# EAGLE board Talon_I2C (EAGLE 9.6.2)
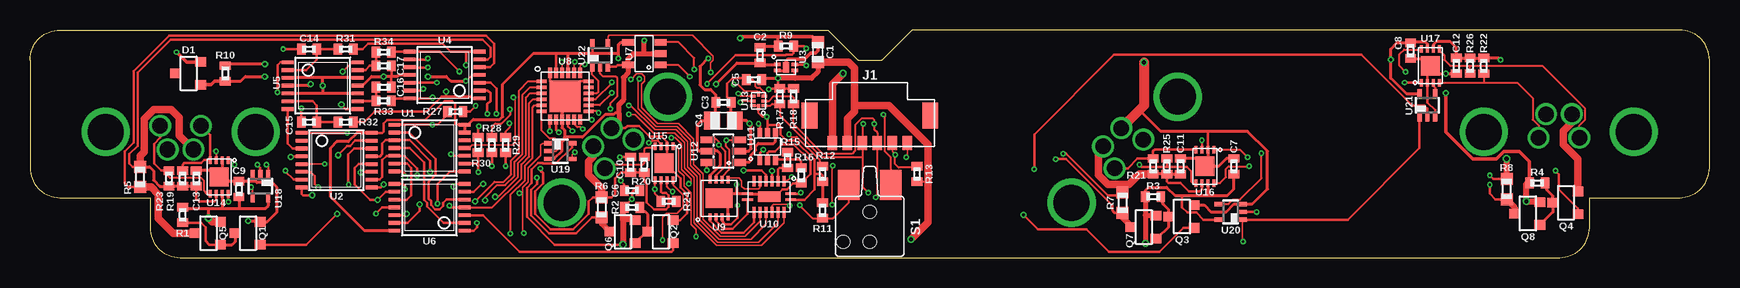
[diagram p3: board, top side]
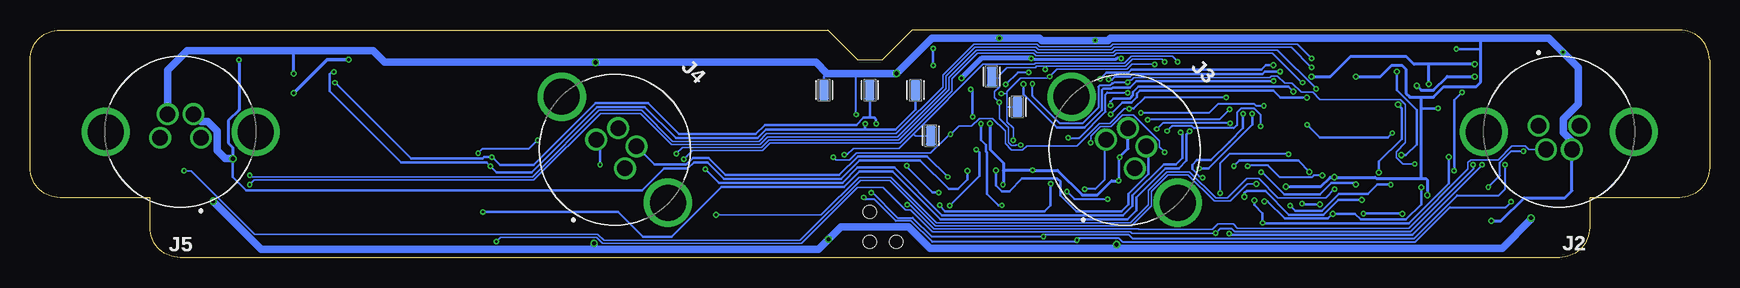
[diagram p4: board, bottom side, seen from below]

Size 140 x 19 mm. Coordinates in mm from the lower left corner, seen from the top.
Outline: 130,5 137.5,5 arc90 140,7.5 140,16.5 arc90 137.5,19 73.5,19 71,16.5 69,16.5 66.5,19 2.5,19 arc90 0,16.5 0,7.5 arc90 2.5,5 10,5 10,2.5 arc90 12.5,0 127.5,0 arc90 130,2.5 130,5
Copper layers (1*16): Top 0.035559375mm / dielectric 1.6mm / Bottom 0.035559375mm
Design rules "jlcpcb-2layer *": minimum track width 5mil, minimum drill 0.2mm, track to track 5mil, track to pad 5mil, pad to pad 5mil, via to via 6mil, smd to smd 5mil, copper to edge 15mil, drill to drill 0.5mm, minimum pad ring 5mil, minimum via ring 5mil, stop-mask expansion 2.5mil, vias tented up to drill 0mil, thermal gap 10mil

## Footprints (pad centres in the part's own frame; a part is rotated, then mirrored left to right if it is on the bottom)
C0603 = smd 1 x 1: 1 -0.85,0; 2 0.85,0
C0402 = smd 0.7 x 0.9: 1 -0.65,0; 2 0.65,0
C0805 = smd 1.3 x 1.5: 1 -0.95,0; 2 0.95,0
SOT23-3 = smd 0.8 x 0.9: 1 -0.95,-1; 2 0.95,-1; 3 0,1.1
1X06_MICROLOCKPLUS = smd 0.8 x 1.2: 1 -3.125,-0.6; 2 -1.875,-0.6; 3 -0.625,-0.6; 4 0.625,-0.6; 5 1.875,-0.6; 6 3.125,-0.6 | smd 1.3 x 2.15: BODY@1 -5.025,1.695; BODY@2 5.025,1.695
1X04_M8_TE_T404103_BOARDLOCK = drill 1.3: 1 1.7,-0.5; 2 1.075,1.475; 3 -1.7,-0.5; 4 -1.075,1.475 | drill 3: S1 -6.25,0; S2 6.25,0
R0402 = smd 0.7 x 0.9: 1 -0.65,0; 2 0.65,0
R0603 = smd 1 x 1: 1 -0.85,0; 2 0.85,0
ESE-22MH = smd 1.8 x 2.5: 1 -1.75,-2.25; 2 1.75,-2.25 | hole 1.1: 0,0; 0,2.5; 2.2,2.5
TESTPOINT_0603 = smd 1.6 x 0.8: 1 0,0
TSSOP14 = smd 0.305 x 0.991: 1 -1.95,-2.918; 2 -1.3,-2.918; 3 -0.65,-2.918; 4 0,-2.918; 5 0.65,-2.918; 6 1.3,-2.918; 7 1.95,-2.918; 8 1.95,2.918; 9 1.3,2.918; 10 0.65,2.918; 11 0,2.918; 12 -0.65,2.918; 13 -1.3,2.918; 14 -1.95,2.918
TSSOP16 = smd 0.305 x 0.991: 1 -2.275,-2.918; 2 -1.625,-2.918; 3 -0.975,-2.918; 4 -0.325,-2.918; 5 0.325,-2.918; 6 0.975,-2.918; 7 1.625,-2.918; 8 2.275,-2.918; 9 2.275,2.918; 10 1.625,2.918; 11 0.975,2.918; 12 0.325,2.918; 13 -0.325,2.918; 14 -0.975,2.918; 15 -1.625,2.918; 16 -2.275,2.918
TDFN_4 = smd 0.55 x 0.3: 1 -0.725,0.25; 2 -0.725,-0.25; 3 0.725,-0.25; 4 0.725,0.25 | smd 0.5 x 0.86: EP 0,0
SOT23-5 = smd 0.55 x 1: 1 -0.95,-1.35; 2 0,-1.35; 3 0.95,-1.35; 4 0.95,1.35; 5 -0.95,1.35
QFN24 = smd 0.85 x 0.3: 1 -1.95,1.25; 2 -1.95,0.75; 3 -1.95,0.25; 4 -1.95,-0.25; 5 -1.95,-0.75; 6 -1.95,-1.25; 13 1.95,-1.25; 14 1.95,-0.75; 15 1.95,-0.25; 16 1.95,0.25; 17 1.95,0.75; 18 1.95,1.25 | smd 0.3 x 0.85: 7 -1.25,-1.95; 8 -0.75,-1.95; 9 -0.25,-1.95; 10 0.25,-1.95; 11 0.75,-1.95; 12 1.25,-1.95; 19 1.25,1.95; 20 0.75,1.95; 21 0.25,1.95; 22 -0.25,1.95; 23 -0.75,1.95; 24 -1.25,1.95 | smd 2.6 x 2.6: EP 0,0
DFN_8_3X3 = smd 0.6 x 0.25: 1 -1.55,0.75; 2 -1.55,0.25; 3 -1.55,-0.25; 4 -1.55,-0.75; 5 1.55,-0.75; 6 1.55,-0.25; 7 1.55,0.25; 8 1.55,0.75 | smd 1.65 x 2.25: EP 0,0
VQFN-16 = smd 0.9 x 0.24: 1 -1.8,-0.25; 8 1.8,-0.25; 9 1.8,0.25; 16 -1.8,0.25 | smd 0.24 x 0.9: 2 -1.25,-1.3; 3 -0.75,-1.3; 4 -0.25,-1.3; 5 0.25,-1.3; 6 0.75,-1.3; 7 1.25,-1.3; 10 1.25,1.3; 11 0.75,1.3; 12 0.25,1.3; 13 -0.25,1.3; 14 -0.75,1.3; 15 -1.25,1.3 | smd 1.9 x 0.9: EP 0,0
DCK_R-PDSO-G6 = smd 0.4 x 0.9: 1 -0.65,-1.1; 2 0,-1.1; 3 0.65,-1.1; 4 0.65,1.1; 5 0,1.1; 6 -0.65,1.1
SOT23-6L = smd 0.55 x 1.2: 1 -0.95,-1.3; 2 0,-1.3; 3 0.95,-1.3; 4 0.95,1.3; 5 0,1.3; 6 -0.95,1.3
UQFN-8_1.4X1.2 = smd 0.55 x 0.25: 1 -0.53,0 | smd 0.25 x 0.45: 2 -0.4,-0.475; 3 0,-0.475; 4 0.4,-0.475; 6 0.4,0.475; 7 0,0.475; 8 -0.4,0.475 | smd 0.45 x 0.25: 5 0.58,0
WSON-8_2X3 = smd 0.25 x 0.625: 1 -0.75,-1.4; 2 -0.25,-1.4; 3 0.25,-1.4; 4 0.75,-1.4; 5 0.75,1.4; 6 0.25,1.4; 7 -0.25,1.4; 8 -0.75,1.4 | smd 1.6 x 1.6: EP 0,0
DCK_R-PDSO-G5 = smd 0.35 x 0.8: 1 -0.65,-0.95; 2 0,-0.95; 3 0.65,-0.95; 4 0.65,0.95; 5 -0.65,0.95

## Placement (x,y rotation side)
C1  1uF  [C0603]  65.68,17.14 90 top
C2  0.1uF  [C0402]  60.86,16.89 90 top
C3  0.1uF  [C0402]  57.81,12.95 0 top
C4  10uF  [C0805]  57.81,11.43 0 top
C5  0.1uF  [C0402]  60.35,14.86 180 top
C6  0.1uF  [C0402]  50.19,5.59 180 top
C7  0.1uF  [C0402]  100.35,7.62 90 top
C8  0.1uF  [C0402]  115.09,17.27 270 top
C9  0.1uF  [C0402]  17.42,5.71 90 top
C10  0.1uF  [C0402]  50.06,7.75 90 top
C11  0.1uF  [C0402]  95.91,7.62 90 top
C12  0.1uF  [C0402]  118.9,16 270 top
C13  0.1uF  [C0402]  13.87,6.6 90 top
C14  DNP  [C0402]  23.26,17.4 180 top
C15  DNP  [C0402]  23.26,11.3 180 top
C16  DNP  [C0402]  29.49,14.22 0 top
C17  DNP  [C0402]  29.49,16 0 top
D1  2.048V  [SOT23-3]  13.23,15.37 90 top
J1  CONN_TALON_REMOTE  [1X06_MICROLOCKPLUS]  70,10.16 0 top
J2  CONN_I2C_LOGGER  [1X04_M8_TE_T404103_BOARDLOCK]  12.55,10.5 180 bottom
J3  CONN_I2C_LOGGER  [1X04_M8_TE_T404103_BOARDLOCK]  48.75,9 315 bottom
J4  CONN_I2C_LOGGER  [1X04_M8_TE_T404103_BOARDLOCK]  91.25,9 315 bottom
J5  CONN_I2C_LOGGER  [1X04_M8_TE_T404103_BOARDLOCK]  127.45,10.5 0 bottom
Q1  2N7002  [SOT23-3]  18.18,2.03 90 top
Q2  2N7002  [SOT23-3]  52.6,2.16 90 top
Q3  2N7002  [SOT23-3]  96.03,3.43 90 top
Q4  2N7002  [SOT23-3]  128.04,4.57 90 top
Q5  AO3419  [SOT23-3]  14.88,2.03 90 top
Q6  AO3419  [SOT23-3]  49.43,2.16 90 top
Q7  AO3419  [SOT23-3]  92.86,2.54 90 top
Q8  AO3419  [SOT23-3]  124.86,3.68 90 top
R1  10k  [R0402]  12.72,3.56 90 top
R2  10k  [R0402]  50.19,4.19 180 top
R3  10k  [R0402]  93.62,5.08 180 top
R4  10k  [R0402]  125.64,6.22 180 top
R5  82m  [R0603]  9.17,6.73 90 top
R6  82m  [R0603]  47.65,4.19 90 top
R7  82m  [R0603]  91.08,4.57 90 top
R8  82m  [R0603]  123.09,5.71 90 top
R9  100k  [R0402]  63.02,17.65 0 top
R10  10k  [R0402]  16.28,15.37 90 top
R11  1M  [R0402]  66.06,3.94 90 top
R12  100k  [R0402]  66.06,6.99 270 top
R13  100k  [R0402]  73.94,6.99 270 top
R15  10k  [R0402]  63.14,8.13 270 top
R16  10k  [R0402]  64.28,6.86 90 top
R17  10k  [R0402]  62.51,13.46 90 top
R18  10k  [R0402]  63.65,13.46 90 top
R19  10k  [R0402]  12.72,6.6 270 top
R20  10k  [R0402]  51.2,7.75 270 top
R21  10k  [R0402]  93.62,7.62 270 top
R22  10k  [R0402]  121.18,16 90 top
R23  10k  [R0402]  11.58,6.6 270 top
R24  10k  [R0402]  53.24,4.7 0 top
R25  10k  [R0402]  94.77,7.62 270 top
R26  10k  [R0402]  120.04,16 90 top
R27  1k  [R0402]  35.46,12.19 180 top
R28  1k  [R0402]  38.5,9.4 270 top
R29  1k  [R0402]  39.65,9.4 270 top
R30  1k  [R0402]  37.36,9.4 270 top
R31  1k  [R0402]  26.31,17.4 180 top
R32  1k  [R0402]  26.31,11.3 180 top
R33  1k  [R0402]  29.49,13.08 180 top
R34  1k  [R0402]  29.49,17.14 180 top
S1  ESE-22MH  [ESE-22MH]  70,3.81 180 top
TP1  TESTPOINTRCU  [TESTPOINT_0603]  73.81,13.97 270 bottom
TP2  TESTPOINTRCU  [TESTPOINT_0603]  70,13.97 270 bottom
TP3  TESTPOINTRCU  [TESTPOINT_0603]  66.19,13.97 270 bottom
TP4  TESTPOINTRCU  [TESTPOINT_0603]  59.84,15.11 270 bottom
TP5  TESTPOINTRCU  [TESTPOINT_0603]  57.68,12.57 270 bottom
TP6  TESTPOINTRCU  [TESTPOINT_0603]  64.92,10.16 270 bottom
U1  SN74HC04  [TSSOP14]  33.3,9.14 270 top
U2  CD4044  [TSSOP16]  25.55,8.13 270 top
U3  SIP32431TDFN  [TDFN_4]  63.02,15.88 0 top
U4  INA4180A2  [TSSOP14]  34.57,15.24 90 top
U5  MAX9034TSSOP  [TSSOP14]  24.41,14.35 270 top
U6  SN74AC08  [TSSOP14]  33.3,4.19 90 top
U7  AT24MAC602SOT23  [SOT23-5]  51.2,17.02 90 top
U8  PCAL9535AQFN  [QFN24]  44.6,13.46 0 top
U9  PCA9536DFN  [DFN_8_3X3]  57.43,4.95 90 top
U10  74HC4852  [VQFN-16]  61.62,5.08 180 top
U11  SN74LVC1G3157SC70  [DCK_R-PDSO-G6]  61.49,9.27 0 top
U12  MCP3421A3  [SOT23-6L]  57.81,8.89 90 top
U13  FXMAR2102UMLP  [UQFN-8_1.4X1.2]  60.73,13.08 90 top
U14  PCA9617WSON  [WSON-8_2X3]  15.77,6.73 180 top
U15  PCA9617WSON  [WSON-8_2X3]  52.86,7.87 180 top
U16  PCA9617WSON  [WSON-8_2X3]  97.94,7.62 180 top
U17  PCA9617WSON  [WSON-8_2X3]  116.74,16 0 top
U18  SN74AUP1G08DCK  [DCK_R-PDSO-G5]  19.2,5.97 180 top
U19  SN74AUP1G08DCK  [DCK_R-PDSO-G5]  44.22,8.89 270 top
U20  SN74AUP1G08DCK  [DCK_R-PDSO-G5]  100.1,3.81 90 top
U21  SN74AUP1G08DCK  [DCK_R-PDSO-G5]  116.48,12.7 0 top
U22  SN74AUP1G32DCK  [DCK_R-PDSO-G5]  47.52,16.89 0 top

## Tracks (layer width: path | path; a pad name or v marks a point on that pad's centre or on a via)
3V3  (via drill 0.2, 0.25, 0.35)
  Top 0.152: U15.7 53.11,5.91 53.52,5.5 v53.56,5.5 | v61.43,11.75 61.05,11.75 60.73,12.06 U13.1 60.73,12.68 U13.8 | R13.2 73.95,6.35 74.85,6.35
  Top 0.2: R12.2 66.06,6.86 65.94,6.99 65.39,6.99 | U10.16 64.54,4.83 65.39,5.67 65.39,6.99 | 65.39,6.99 65.39,8.17 63.78,9.78 63.08,9.78 62.57,10.29 62.57,10.91 62.44,11.05 61.49,11.05 | U18.5 19.85,5.27 | C6.1 50.31,5.59 50.18,5.45 v50.18,4.89 49.54,4.25 R2.2 49.54,4.32 | U19.5 45.17,9.21 43.8,7.84 42.77,7.84 42.72,7.89 42.34,7.89 41.81,7.36 41.81,6.21 41.43,5.83 41.43,3.4 43.74,1.08 v49.43,1.08 | U20.5 97.83,3.16 97.24,3.75 96.49,3.75 96.03,4.21 96.03,5.17 | U1.14 35.54,11.09 35.46,11.18 35.46,12.83 35.2,13.08 34.56,13.08 32.95,11.47 29.79,11.47 29.49,11.17 29.49,10.54 29.35,10.4 U2.16 | v61.43,11.75 61.49,11.68 61.49,11.05 | 61.49,11.05 U11.5 | v61.57,14.06 61.62,14.11 R17.2 | R17.2 63.61,14.11 63.63,14.13 | v62.36,14.96 62.36,14.26 R17.2 | U8.23 43.85,17.05 43.84,17.06 | U22.5 46.89,17.83 46.89,17.06
  Top 0.254: C4.1 57.17,11.12 | C4.1 55.97,11.43 55.65,11.11 55.65,9.02 55.78,8.89 U12.5 | U12.5 56.41,8.89 | U6.14 27.88,2.24 25.04,5.08 25.04,9.14 25.57,9.67 26.52,9.67 27.26,10.4 U2.16 | R12.2 R11.2 | C4.1 57.16,11.73 C3.1 57.16,13.6 56.74,14.02 56.23,14.02 55.85,14.4 55.85,15.95 v56.54,16.64 | U1.13 U1.14 36.52,11.09 36.95,11.52 39.16,11.52 39.4,11.76 39.4,14.48 41.97,17.06 43.84,17.06 44.85,17.06 | v49.04,16.64 v49.05,16.64 49.05,17.02 | U9.8 56.68,6.87 57.55,7.75 57.55,8.64 57.3,8.89 U12.5 | R3.2 92.97,5.6 93.24,5.87 94.75,5.87 95.44,5.17 96.03,5.17 98.19,5.17 | C7.1 100.35,5.71 99.81,5.17 98.19,5.17 | U16.7 98.19,5.17 | U17.7 116.49,17.83 116.28,18.03 115.2,18.03 C8.1 113.96,17.92 113.43,17.4 v113.43,16.51 113.43,14.98 114.76,13.65 U21.5 | C5.1 61.1,14.96 v62.36,14.96 | U3.3 63.74,15 63.78,14.96 | 63.63,14.13 R18.2 | 49.05,17.02 49.05,17.78 49.23,17.97 U7.4 | U18.5 19.85,4.33 19.58,4.06 17.42,4.06 | 17.42,4.06 16.02,4.06 | 16.02,4.06 14.88,4.06 | 14.88,4.06 12.87,4.06 R1.2 | v14.88,3.3 14.88,4.06 | U14.7 16.02,4.07 16.02,4.06 | C9.1 17.42,4.06 | 49.05,17.02 49,17.06 46.89,17.06 44.85,17.06 | U8.21 44.85,17.05 44.85,17.06
  Top 0.305: R4.2 124.99,8.01 124.16,8.84 122.84,8.84 122.22,8.21 120.25,8.21 118.01,10.46 v118.01,13.72
  Top 0.406: v92.98,1.19 92.97,1.2 92.97,3.56 | R3.2 92.97,3.56 | 92.97,3.56 93.04,3.49 Q7.2 | C1.1 65.68,15.49 65.15,14.96 63.78,14.96 v62.36,14.96
  Top 0.508: 49.43,3.17 49.43,4.1 R2.2 | Q6.2 50.36,3.17 49.43,3.17 | R4.2 124.74,6.17 v124.74,4.7 124.8,4.63 Q8.2 | 49.43,3.17 v49.43,1.08
  Top 0.61: 15.8,3.06 Q5.2 15.2,2.98 v14.88,3.3 | C1.1 68.23,16.3 68.72,15.81 68.72,12.7 | v73.43,1.52 74.85,2.94 74.85,6.35 74.85,9.45 71.6,12.7 68.72,12.7 | J1.2 68.12,11.59 68.72,12.18 68.72,12.7
  Bottom 0.152: v50.18,4.89 52.95,4.89 v53.56,5.5
  Bottom 0.2: v61.57,14.06 61.43,13.91 v61.43,11.75
  Bottom 0.254: v49.05,16.64 49.39,16.64 49.49,16.54 56.44,16.54 v56.54,16.64 56.51,16.61 56.54,16.61
  Bottom 0.305: v118.01,13.72 115.21,16.51 v113.43,16.51
  Bottom 0.406: v56.54,16.64 60.68,16.64 v62.36,14.96
  Bottom 0.61: v14.88,3.3 14.88,3.17 17.27,0.79 49.3,0.79 | 49.3,0.79 64.99,0.79 66.75,2.55 72.41,2.55 v73.43,1.52 74.27,0.69 92.99,0.69 | 92.99,0.69 120.72,0.69 v124.74,4.7 | v92.98,1.19 v92.99,1.19 92.99,0.69 | v49.43,1.08 49.43,0.91 49.3,0.79
3V3_SENSE  (via drill 0.2, 0.25)
  Top 0.2: v36.34,14.73 36.85,15.24 U4.4
  Top 0.254: v23.39,14.48 23.26,14.35 U5.4 | v19.58,16.13 16.37,16.13 R10.2 | v57.17,14.48 58.94,16.24 C2.1 60.97,16.12 U3.1 | v33.17,15.11 34.69,15.11 35.08,14.73 v36.34,14.73
  Bottom 0.2: v57.17,14.48 57.17,13.62 54.41,10.86 52.11,10.86 50.66,12.31 50.66,13.97 50.54,14.09 49.84,14.09 49.74,14.19 48.33,14.19 47.79,14.73 36.48,14.73 36.47,14.73 v36.34,14.73
  Bottom 0.254: v33.17,15.11 31.61,15.11 29.95,16.77 25.27,16.77 24.63,16.13 23.39,16.13 | v19.58,16.13 23.39,16.13 | v23.39,14.48 23.39,16.13
!FAULT1  (via drill 0.2, 0.25)
  Top 0.2: U1.8 35.03,7.19 33.98,6.14 v33.98,4.5 | U6.13 31.49,2.89 32.49,3.89 v32.49,4.44
  Bottom 0.2: v32.49,4.44 33.92,4.44 v33.98,4.5
!FAULT2
  Top 0.2: U1.4 31.65,9.14 32.86,7.93 32.86,4.82 33.11,4.58 33.11,4.25 34.47,2.89 U6.2
!FAULT3
  Top 0.2: U1.6 31.42,7.84 31.77,7.49 31.77,5.21 31.39,4.83 30.39,4.83 U6.10
!FAULT4
  Top 0.2: U1.2 31.62,10.44 33.83,8.23 33.83,6.88 33.24,6.3 33.24,4.9 33.43,4.71 33.43,4.39 33.79,4.04 34.16,4.04 34.43,4.3 34.43,4.56 34.71,4.84 U6.5
!I2C_OB_EN  (via drill 0.2)
  Top 0.127: v101.11,1.34 101.05,1.41 U20.1 | 41.04,2.16 41.04,5.33 | 41.04,5.33 41.04,5.85 41.52,6.33 41.52,7.48 42.57,8.53 42.57,9.4 42.71,9.54 U19.1 | v40.81,5.39 40.99,5.39 41.04,5.33
  Top 0.152: v41.17,2.03 41.04,2.16 | v19.71,7.75 19.85,7.61 U18.1 | U1.10 35.22,8.49 v35.08,8.64
  Top 0.2: U20.1 109.86,3.16 115.83,9.13 U21.1
  Bottom 0.127: v41.17,2.03 48.16,2.03 48.28,2.15 64.77,2.15 66.59,3.98 67.04,3.98 68.9,5.84 71.02,5.84 75.68,1.18 92.27,1.18 92.78,1.69 100.77,1.69 v101.11,1.34
  Bottom 0.152: v41.17,2.03 40.77,2.44 39.85,2.44 39.6,2.18 24.91,2.18 19.71,7.38 v19.71,7.75 | v35.08,8.64 40.03,8.64 40.81,7.86 v40.81,5.39
DATA1_EN  (via drill 0.2)
  Top 0.152: v40.03,2 40.03,5.22 41.25,6.44 41.25,7.67 41.89,8.32 41.89,12.54 42.07,12.71 U8.5
  Top 0.2: v18.95,7.75 19.2,7.49 U18.2
  Bottom 0.2: v40.03,2 39.9,1.88 24.78,1.88 18.95,7.71 v18.95,7.75
DATA1_EN_LOCAL  (via drill 0.2)
  Top 0.152: v18.44,5.88 18.55,5.77 U18.4 | v15.52,8.89 U14.3
  Bottom 0.152: v18.44,5.88 17.47,6.85 17.47,7.92 16.51,8.89 v15.52,8.89
DATA2_EN
  Top 0.152: U19.2 43.84,8.89 43.97,9.02 43.97,9.71 43.75,9.92 43.33,9.92 42.65,10.6 U8.6
DATA2_EN_LOCAL  (via drill 0.2)
  Top 0.127: U19.4 45.17,8.55 v45.41,8.8
  Top 0.152: v51.57,9.58 51.68,9.58 51.9,9.79 52.31,9.79 52.61,9.5 U15.3
  Bottom 0.127: v51.57,9.58 51.57,10.14 50.76,10.95 49.88,10.95 48.92,11.9 48.01,11.9 45.85,9.74 45.85,9.23 v45.41,8.8
DATA3_EN  (via drill 0.2)
  Top 0.2: v102.26,3.81 U20.2 | v43.33,10.54 43.33,11.49 U8.7
  Bottom 0.2: v102.26,3.81 90.96,3.81 88.88,1.73 86.53,1.73 82.34,5.92 72.14,5.92 70.87,7.18 68.09,7.18 64.11,3.21 48.5,3.21 47.77,3.94 47.77,5.04 45.36,7.45 44.22,7.45 43.58,8.09 43.58,10.29 v43.33,10.54
DATA3_EN_LOCAL  (via drill 0.2)
  Top 0.152: U20.4 99.9,4.46 100.28,4.84 100.86,4.84 102.65,6.62 v102.65,8.71 | v97.69,9.8 U16.3
  Bottom 0.152: v102.65,8.71 102.27,9.09 98.4,9.09 v97.69,9.8
DATA4_EN  (via drill 0.2)
  Top 0.2: v83.72,7.39 83.72,10.29 90.36,16.93 110.99,16.93 115.21,12.7 116.23,12.7 116.48,12.45 U21.2 | v44.07,10.44 43.85,10.66 U8.8
  Bottom 0.2: v83.72,7.39 82.57,6.24 72.27,6.24 71,7.51 67.95,7.51 63.97,3.53 48.89,3.53 48.1,4.32 48.1,5.17 45.5,7.78 44.47,7.78 43.95,8.31 43.95,10.31 v44.07,10.44
DATA4_EN_LOCAL
  Top 0.2: U21.4 117.13,14.16 116.99,14.3 U17.3
EN1  (via drill 0.25)
  Top 0.152: v37.1,4.7 38.73,6.33 39.49,6.33 40.11,6.95 40.11,8.12 40.78,8.78 40.78,13.96 41.53,14.71 U8.1
  Top 0.2: v31.39,3.66 31.27,3.54 U6.12 | v24.03,5.84 23.71,6.16 23.71,6.79 23.35,7.15 U2.6
  Bottom 0.2: v37.1,4.7 36.85,4.7 35.4,3.25 31.8,3.25 v31.39,3.66 29.56,3.66 29.08,3.17 25.3,3.17 24.03,4.45 v24.03,5.84
EN2  (via drill 0.2, 0.25)
  Top 0.152: v37.93,4.76 37.93,5.02 38.96,6.04 39.61,6.04 40.39,6.83 40.39,8 41.06,8.67 41.06,13.6 41.67,14.21 U8.2
  Top 0.2: U6.1 36.98,2.24 37.25,2.52 v37.25,2.9 | v21.74,8.38 21.81,8.45 U2.4
  Bottom 0.2: v37.93,4.76 37.93,4.38 37.25,3.71 v37.25,2.9 37.2,2.85 25.07,2.85 21.74,6.17 v21.74,8.38
EN3  (via drill 0.25)
  Top 0.152: v38.76,5.08 39.03,5.08 40.67,6.71 40.67,7.88 41.34,8.55 41.34,13.37 41.67,13.71 U8.3
  Top 0.2: U6.9 29.64,5.49 v28.98,4.83 28.34,4.83 27.07,6.1 27.07,7.49 27.38,7.8 U2.12
  Bottom 0.2: v38.76,5.08 38.76,5.38 38.58,5.57 37.03,5.57 35.05,3.58 32.17,3.58 30.93,4.83 v28.98,4.83
EN4  (via drill 0.2)
  Top 0.152: U6.4 38.54,4.19 40.97,6.62 40.97,7.79 41.62,8.43 41.62,12.89 41.94,13.21 U8.4
  Top 0.2: U2.14 27.03,9.1 26.54,8.61 26.54,6.11 v26.56,6.09 | v34.95,4.32 35.08,4.19 U6.4
  Bottom 0.2: v26.56,6.09 27.7,6.09 28.47,5.33 30.89,5.33 32.31,3.91 34.54,3.91 v34.95,4.32
FAULT1  (via drill 0.2, 0.25)
  Top 0.2: v37.36,7.13 37.36,7.87 | 37.36,7.87 R30.2 | U2.9 29.24,5.85 v29.49,6.1 | U1.9 36.24,7.87 37.36,7.87
  Bottom 0.2: v29.49,6.1 29.61,6.22 31.52,6.22 32.46,5.28 35.45,5.28 37.3,7.13 v37.36,7.13
FAULT1_SENSE  (via drill 0.2)
  Top 0.152: v45.21,10.56 44.85,10.93 U8.10
  Top 0.2: R30.1 37.36,10.92 v37.4,10.96
  Bottom 0.152: v37.4,10.96 37.4,11.89 37.95,12.43 39.06,12.43 39.39,12.1 39.39,11.05 39.65,10.79 42.97,10.79 43.15,10.97 44.8,10.97 v45.21,10.56
FAULT2  (via drill 0.2, 0.25)
  Top 0.2: v39.65,7.64 R29.2 | U2.13 29.18,8.45 29.36,8.64 29.36,9.53 29.63,9.79 U1.3 31.63,9.79 33.34,8.08 v33.34,7.16
  Bottom 0.2: v33.34,7.16 34.28,8.1 39.19,8.1 v39.65,7.64
FAULT2_SENSE  (via drill 0.2)
  Top 0.152: v39.97,11.22 39.97,10.84 39.65,10.52 R29.1 | v46.06,10.73 45.91,10.88 45.62,10.88 45.35,11.15 U8.11
  Bottom 0.152: v39.97,11.22 39.99,11.25 45.54,11.25 v46.06,10.73
FAULT3  (via drill 0.2, 0.25)
  Top 0.2: v32.28,6.86 32.28,7.45 31.23,8.49 U1.5 29.73,8.49 29.36,8.13 29.36,6.73 29.13,6.5 U2.10 | v38.5,7.64 R28.2
  Bottom 0.152: v32.28,6.86 33,6.86 33.16,6.7 35.81,6.7 36.8,7.69 38.45,7.69 v38.5,7.64
FAULT3_SENSE  (via drill 0.2)
  Top 0.152: R28.1 38.5,10.92 38.77,11.19 39.29,11.19 40,11.9 v40,12.37 | v46.83,11.49 45.87,11.49 U8.12
  Bottom 0.152: v40,12.37 40.85,11.53 44.6,11.53 45.43,11.53 46.79,11.53 v46.83,11.49
FAULT4  (via drill 0.2)
  Top 0.2: U2.1 v26.44,10.4 | R27.2 34.81,11.94 33.96,11.09 v33.55,11.09 U1.1
  Bottom 0.2: v26.44,10.4 26.82,10.02 32.47,10.02 v33.55,11.09
FAULT4_SENSE  (via drill 0.2)
  Top 0.152: v47.39,12.07 47.25,12.21 U8.13
  Top 0.2: R27.1 36.68,12.19 v37.15,12.66
  Bottom 0.152: v37.15,12.66 37.78,12.66 37.92,12.8 40.98,12.8 41.72,12.07 v47.39,12.07
GND  (via drill 0.2, 0.25, 0.35)
  Top 0.152: C5.2 60.22,14.86 60.45,14.63 60.45,14.32 60.56,14.21 60.82,14.21 61.2,13.82 U13.4 | S1.1 71.75,8.36 71.27,8.84 71.27,11.81 v71.14,11.94 | 43.28,8.26 U19.3
  Top 0.2: U12.6 56.41,7.84 v56.41,7.29 | U10.EP 62.13,5.08 62.75,5.7 63.11,5.7 63.61,6.21 R16.1 65.05,6.97 65.05,8.05 63.64,9.45 62.7,9.45 62.09,8.85 61.59,8.85 61.49,8.75 U11.2 | v31.27,6.71 31.27,6.96 31.03,7.19 U1.7 | U6.7 35.53,6.14 v35.3,5.92 | Q2.2 54.19,3.11 54.76,3.68 54.76,5.32 54.22,5.86 54.22,6.61 52.96,7.87 U15.EP 53.11,8.12 U15.2 53.11,9.66 52.64,10.12 51.64,10.12 50.78,10.99 49.79,10.99 49.61,10.8 J3.4 | C6.2 49.54,6.11 v49.24,6.41 | v49.17,8.38 49.19,8.4 C10.2 | 92.99,13.84 92.86,13.71 | U21.3 117.13,12.3 116.49,12.95 U17.2 116.49,15.75 116.67,15.94 U17.EP | C3.2 58.46,13.06 58.12,13.4 58.12,14.54 58.56,14.99 59.57,14.99 C5.2 | U16.2 98.19,10.54 | C14.2 v21.1,17.4 | C15.2 22.61,12.43 v22.63,12.45 | 49.05,12.06 48.92,12.06 | U2.8 22.63,5.33 22.76,5.21 v23.52,5.21 | C17.2 30.14,15.13 30.12,15.11 30.12,14.24 C16.2 | U8.24 43.35,14.71 44.47,13.59 U8.EP 45.85,14.71 U8.18 | U22.3 48.86,15.94 48.98,16.07 U7.5
  Top 0.254: U5.11 27.71,14.35 28.47,15.11 v29.49,15.11 30.12,15.11 30.63,15.11 30.76,15.24 U4.11 | 58.82,5.33 U10.8 61.37,5.33 U10.EP | 58.82,5.33 57.8,5.33 U9.EP 58.18,4.2 U9.4 | U12.2 59.9,8.89 60.11,9.1 60.11,11.04 v59.97,11.18 59.71,11.43 C4.2 58.46,11.73 C3.2 | v58.9,6.1 58.9,5.4 58.82,5.33 | U3.2 62.89,15.62 63.02,15.75 U3.EP | C2.2 60.97,17.65 R9.1 62.37,18.42 62.38,18.43 | 49.1,12.06 48.92,12.06 48.79,12.06 48.66,11.94 47.96,11.94 46.06,10.04 44.56,10.04 44.55,10.03 | U14.2 16.02,6.98 U14.EP | U16.2 98.19,7.87 U16.EP | C7.2 99.73,8.27 99.08,7.62 U16.EP | Q3.2 97.88,4.38 98.45,3.81 99.72,3.81 100.37,4.46 U20.3 101.89,4.46 103.15,5.71 103.15,8.89 101.5,10.54 98.19,10.54 94.26,10.54 92.48,12.32 | C8.2 115.99,16.62 116.67,15.94 | U17.EP 117.39,15.35 v118.01,15.35 C12.2 | U14.EP 15.25,7.25 C13.2 | v18.18,3.05 19.12,3.05 Q1.2 19.77,2.98 20.6,3.81 20.6,5.84 20.17,6.26 18.92,6.26 18.82,6.37 18.56,6.37 | 18.56,6.37 C9.2 16.14,6.37 U14.EP | U18.3 18.56,6.9 18.56,6.37 | U8.9 44.35,10.84 44.55,10.64 44.55,10.03 | 43.28,8.26 43.7,8.26 44.32,8.87 44.32,9.62 44.55,9.86 44.55,10.03 | U16.EP 97.29,8.27 C11.2
  Top 0.305: 58.5,11.43 C4.2 58.66,11.53 | 65.68,17.91 C1.2 | U3.EP 63.02,16.38 63.19,16.55 64.55,16.55 65.07,17.07 65.48,17.07 65.68,17.27 C1.2 | C1.2 65.25,18.43 62.38,18.43 59.32,18.43 v59.2,18.31 | D1.2 13.04,16.32 v12.22,17.14 | U8.9 44.35,13.47 44.47,13.59
  Top 0.406: 51.2,17.02 U7.2 | 51.2,17.02 50.3,17.02 49.85,16.58 U7.5 49.85,15.42 49.47,15.03 49.47,13.15 49.1,12.78 49.1,12.06 49.1,11.43 J3.4 | 51.2,17.02 v51.2,18.11
  Top 0.61: v67.77,15.37 66.88,14.48 J1.1 | J5.4 128.53,11.27 127.81,10.56 127.81,9.44 129.04,8.21 Q4.2
  Top 0.813: v92.86,16.29 92.86,13.71 92.86,12.7 92.48,12.32 J4.4
  Bottom 0.152: v71.14,11.94 71.14,15.37
  Bottom 0.2: v49.24,6.41 49.24,8.31 v49.17,8.38 | TP1.1 73.81,15.11 73.56,15.37 | v21.1,17.4 19.07,17.4 | v22.63,12.45 24.05,12.45
  Bottom 0.254: v59.97,11.18 59.97,9.01 58.87,7.92 58.87,7.24 | 58.87,7.24 58.87,6.12 v58.9,6.1 | 58.87,7.24 58.83,7.29 v56.41,7.29 54.34,7.29 52.28,5.22 51.04,5.22 49.85,6.41 v49.24,6.41 | v35.3,5.92 32.4,5.92 31.61,6.71 v31.27,6.71 27.87,6.71 27.77,6.6 24.03,6.6 | v29.49,15.11 27.43,15.11 26.52,16.02 25.59,16.02 25.3,15.72 25.3,13.7 24.99,13.39 24.05,13.39 | v18.18,3.05 17.41,3.05 15.46,5 12.04,5 11.48,5.57 J2.4 | 19.07,18.31 19.07,17.4 19.07,14.65 19.45,14.26 22.15,14.26 23.02,13.39 24.05,13.39 | v118.01,15.35 118.01,17.27 | 24.03,6.6 23.65,6.6 23.52,6.48 v23.52,5.21 | 24.05,13.39 24.05,12.45 24.05,6.63 24.03,6.6 | v49.17,8.38 48.47,9.09 J3.4
  Bottom 0.61: J2.4 11.48,9.73 12.19,10.44 12.19,11.56 10.95,12.8 10.95,15.88 v12.22,17.14 13.38,18.31 19.07,18.31 49.95,18.31 50.15,18.11 v51.2,18.11 55.64,18.11 55.84,18.31 v59.2,18.31 64.82,18.31 v67.77,15.37 71.14,15.37 73.56,15.37 74.48,16.29 v92.86,16.29 110.42,16.29 111.4,17.27 118.01,17.27 126.9,17.27 128.53,15.64 J5.4
I2C_OB_EN  (via drill 0.2)
  Top 0.127: v73.05,8.38 73.12,8.46 J1.6 | U1.11 36.6,9.14 36.85,9.4 40.28,9.4 40.44,9.55 40.44,13.22 v40.3,13.36
  Top 0.152: v63.27,10.29 63.47,10.08 63.9,10.08 65.81,8.18 65.81,7.89 R12.1 | v48.38,12.42 48.38,12.88 48.96,13.46 48.96,14.96 48.81,15.11 47.77,15.11 47.52,15.37 U22.2
  Bottom 0.127: v73.05,8.38 72.83,8.16 71.69,8.16 71.11,8.74 64.92,8.74 63.37,10.29 v63.27,10.29 62.57,10.99 61.51,10.99 60.88,11.62 59.78,11.62 58.7,10.54 58.7,9.5 58.19,8.98 57.25,8.98 56.91,9.33 52.74,9.33 50.87,11.2 49.98,11.2 48.77,12.42 v48.38,12.42
  Bottom 0.152: v40.3,13.36 47.08,13.36 48.01,12.42 v48.38,12.42
INTB  (via drill 0.2)
  Top 0.127: v72.12,8.6 71.88,8.84 J1.5 | U8.22 44.35,16.31 v44.32,16.34
  Top 0.152: R13.1 73.81,7.51 72.41,7.51 72.12,7.81 v72.12,8.6
  Bottom 0.127: v72.12,8.6 71.89,8.6 71.37,9.12 67.57,9.12 66.36,10.33 | 66.36,10.33 60.57,16.13 56.29,16.13 56.19,16.22 48.78,16.22 48.2,16.8 44.78,16.8 v44.32,16.34 | 66.36,10.33 66.19,10.16 TP6.1
LATCH1  (via drill 0.2)
  Top 0.2: U2.7 21.97,6.5 21.29,7.18 v21.29,7.24 | v20.64,13.78 20.64,16.05 20.9,16.3 U5.1
  Bottom 0.2: v21.29,7.24 21.29,8.16 21.26,8.18 21.26,13.16 v20.64,13.78
LATCH2
  Top 0.2: U2.3 21.91,9.1 21.49,9.52 U5.7
LATCH3  (via drill 0.25)
  Top 0.2: U5.8 26.31,12.4 v25.96,12.76 | U2.11 27.6,7.15 v27.56,7.11
  Bottom 0.2: v25.96,12.76 25.65,12.45 25.65,9.91 27.56,8 v27.56,7.11
LATCH4  (via drill 0.25)
  Top 0.2: U2.15 27.11,9.75 26.67,9.31 26.44,9.31 v25.67,8.54 | U5.14 26.85,16.3 v26.06,15.51
  Bottom 0.2: v25.67,8.54 25.29,8.54 24.4,9.43 24.4,12.31 26.06,13.96 v26.06,15.51
LOOPBACK_EN
  Top 0.152: U8.16 47.25,13.71 47.39,13.85 47.39,14.74 46.87,15.26 U22.1
MOS_CTRL1  (via drill 0.2, 0.25)
  Top 0.2: v25.61,3.66 23.03,1.08 Q1.1 | U6.11 29.36,4.19 v28.85,3.68
  Bottom 0.2: v25.61,3.66 25.63,3.68 v28.85,3.68
MOS_CTRL2
  Top 0.2: U6.3 37.76,3.54 40.82,0.48 53.46,0.48 53.6,0.62 Q2.1
MOS_CTRL3  (via drill 0.2, 0.25)
  Top 0.2: U6.8 31.08,6.14 31.26,5.96 v31.26,5.71 | Q3.1 96.15,2.48 94.15,0.48 89.94,0.48 88.07,2.35 84.04,2.35 v82.83,3.56
  Bottom 0.127: v31.26,5.71 31.98,4.99 35.97,4.99 37.57,6.59 38.56,6.59 40.19,4.97 41.17,4.97 43.36,7.16 45.24,7.16 46.78,5.62 46.78,4.42 48.28,2.92 64.44,2.92 68.22,6.71 70.89,6.71 74.05,3.54 82.82,3.54 v82.83,3.56
MOS_CTRL4  (via drill 0.2, 0.25)
  Top 0.2: U6.6 36.97,5.49 37.63,6.14 v37.76,6.14 | v127.15,7.24 127.44,6.95 127.44,5.7 129.04,4.1 Q4.1
  Bottom 0.127: v127.15,7.24 126.58,7.24 121.28,1.94 92.67,1.94 92.16,1.44 75.8,1.44 70.79,6.45 68.33,6.45 64.54,2.66 48.18,2.66 46.53,4.31 46.53,5.51 45.14,6.91 43.46,6.91 41.27,4.71 39.95,4.71 38.52,6.14 v37.76,6.14
MUX_EN
  Top 0.127: U10.6 60.87,5.86 60.73,5.72 59.55,5.72 59.32,5.96 59.32,6.4 59.09,6.63 58.18,6.63 U9.5
MUX_SEL0
  Top 0.2: U9.1 56.67,3.05 57.66,2.06 59.49,2.06 60.37,2.94 U10.10
MUX_SEL1
  Top 0.2: U9.2 57.18,3.04 57.81,2.41 58.57,2.41 59.82,3.66 U10.9
MUX_SEL2  (via drill 0.2, 0.2 pad 0.13)
  Top 0.2: U9.3 57.68,3.04 57.95,2.77 58.42,2.77 58.98,3.32 v58.98,4.35 | v60.73,11.18 60.84,11.06 U11.6
  Bottom 0.2: v60.73,11.18 60.73,9.81 60.32,9.4 60.32,8.86 60.24,8.79 60.24,5.31 59.29,4.35 v58.98,4.35
N$1
  Top 0.254: Q6.1 51.38,2.16 Q2.3 51.5,3.6 50.95,4.16 R2.1
N$2
  Top 0.2: R1.1 14.26,2.91 14.63,2.54 14.63,1.4 14.94,1.08 16.02,1.08
  Top 0.254: Q5.1 16.02,1.08 16.85,1.08 17.08,1.31 Q1.3
N$3
  Top 0.254: Q7.1 93.94,1.59 94.94,2.58 Q3.3 94.94,3.98 94.47,4.45 R3.1
N$4
  Top 0.254: Q8.1 126.94,3.81 Q4.3 126.94,5.13 126.49,5.59 R4.1
N$5
  Top 0.2: R15.2 62.49,7.48 62.37,7.35 U10.3
N$6
  Top 0.2: 63.14,8.17 63.65,8.17 64.11,8.17 64.28,8 R16.2 | R15.1 63.14,8.17 | 63.14,8.17 U11.3
N$7  (via drill 0.2)
  Top 0.127: U22.4 48.17,18.43 48.28,18.54 55.23,18.54 56.96,16.81 56.96,16.47 56.74,16.26 v56.74,15.45 | v58.67,14.45 59.04,14.45 59.57,13.91 60.6,13.91 60.73,13.79 U13.5
  Bottom 0.152: v56.74,15.45 57.66,15.45 v58.67,14.45
N$38  (via drill 0.2)
  Top 0.127: v63.34,4.32 63.22,4.44 62,4.44 61.87,4.31 U10.13
  Top 0.2: U11.1 60.84,8.74 v61.12,9.02
  Bottom 0.2: v61.12,9.02 60.87,8.76 60.87,6.8 v63.34,4.32
PORT1_SCL
  Top 0.152: U14.5 14.78,5.33 14.52,5.59 14.52,6.39 14.27,6.63 11.68,6.63 11.58,6.73 R23.1
  Top 0.2: J2.3 10.85,10.01 10.34,9.5 10.34,7.86 10.95,7.25 R23.1
PORT1_SDA
  Top 0.2: J2.1 15.02,10.23 U14.4 14.5,8.13 14.26,7.89 12.86,7.89 12.72,7.75 R19.1
PORT2_SCL  (via drill 0.2)
  Top 0.152: U15.5 52.09,6.46 v52.09,5.71 52.09,5.32 52.59,4.83 R24.1
  Bottom 0.152: v52.09,5.71 51.2,5.71 50.44,6.48 50.44,9.71 J3.3
PORT2_SDA
  Top 0.152: U15.4 51.98,9.15 51.33,9.15 51.2,9.02 R20.1 51.2,7.87 51.08,7.75 48.2,7.75 J3.1
PORT3_SCL  (via drill 0.2)
  Top 0.2: U16.5 96.94,6.22 96.8,6.36 96.8,7.2 96.45,7.55 94.77,7.55 | v92.48,7.75 92.68,7.55 94.77,7.55 | R25.1 94.77,7.55
  Bottom 0.2: v92.48,7.75 92.48,9.52 J4.3
PORT3_SDA
  Top 0.2: U16.4 93.75,9.02 93.62,8.89 R21.1 92.33,8.27 91.5,7.44 J4.1
PORT4_SCL
  Top 0.152: U17.5 117.49,17.27 117.88,16.88 117.88,16.51 118.39,16 120.04,16 | 120.04,16 126.07,16 129.64,12.44 129.64,11.51 129.15,11.03 J5.3 | R26.1 120.04,16
PORT4_SDA
  Top 0.152: U17.4 121.18,14.6 | 121.18,14.6 123.98,14.6 125.26,13.32 125.26,11.51 125.75,11.03 J5.1 | R22.1 121.18,14.6
POS_DETECT  (via drill 0.2)
  Top 0.127: v53.48,10 53.51,10.03 53.77,10.03 54.32,9.48 54.32,7.36 55.09,6.58 55.09,6.31 v54.93,6.15
  Top 0.152: S1.2 68.25,4.6 66.94,3.29 R11.1 65.24,3.29 v64.16,4.37 | U8.14 47.49,12.71 v48.52,13.73
  Bottom 0.152: v53.48,10 52.54,10 50.35,12.19 50.35,13.62 50.19,13.79 48.57,13.79 v48.52,13.73
  Bottom 0.2: v64.16,4.37 64.16,4.31 63.71,3.86 55.43,3.86 54.93,4.36 v54.93,6.15
SCL  (via drill 0.2)
  Top 0.127: v52.73,1.46 52.73,3.35 53.07,3.7 53.96,3.7 54.43,4.17 54.43,5.23 53.61,6.05 U15.8
  Top 0.152: U13.3 61.62,13.08 62,13.46 63.52,13.46 63.65,13.34 R18.1 63.65,11.12 66.11,8.66 68.51,8.66 68.77,8.92 68.77,11.06 69.29,11.59 70.28,11.59 70.39,11.48 v70.39,11.17 70.39,10.66 70.62,10.42 J1.4 70.65,9.54 70.65,5.17 v70.5,5.02 | U16.8 99.21,6.22 99.7,6.71 99.7,7.4 99.92,7.62 v101.62,7.62 | v114.66,15.49 114.15,16 114.15,16.98 114.55,17.37 115.95,17.37 U17.8
  Top 0.2: v16.53,4.65 16.52,4.66 U14.8
  Bottom 0.152: v16.53,4.65 16.98,4.2 21.63,4.2 24.54,1.29 48.92,1.29 49.22,1.59 52.6,1.59 v52.73,1.46 52.89,1.29 64.78,1.29 66.54,3.05 67.82,3.05 69.66,4.89 70.37,4.89 v70.5,5.02
  Bottom 0.2: v114.66,15.49 114.84,15.49 115.03,15.3 115.03,13.91 109.05,7.93 101.93,7.93 v101.62,7.62 101.12,7.12 98.17,7.12 92.71,12.58 88.75,12.58 86.16,9.99 79.37,9.99 78.66,10.7 70.38,10.7 | TP3.1 66.19,12.35 67.84,10.7 70.38,10.7 | v70.39,11.17 70.39,10.71 70.38,10.7
SCL_OB  (via drill 0.2)
  Top 0.127: U8.19 45.85,15.98 46,16.13 v46.25,16.13 | v59.04,13.69 59.25,13.48 U13.6
  Top 0.152: U9.6 57.68,6.73 58.29,7.34 58.29,9.02 58.03,9.27 v58.03,9.78 59.05,9.78 U12.3 | v55.01,15.1 54.05,16.07 U7.1
  Bottom 0.127: v46.25,16.13 48.16,16.13 48.57,15.71 54.4,15.71 v55.01,15.1 55.14,14.97 57.44,14.97 58.57,13.84 58.57,13.72 | v58.03,9.78 58.03,10.79 58.57,11.33 58.57,12.57 | TP5.1 58.57,12.57 | 58.57,13.72 58.57,12.57 | v59.04,13.69 58.6,13.69 58.57,13.72
SDA  (via drill 0.2)
  Top 0.127: v55.52,1.74 55.52,2.35 55.09,2.78 55.09,5.4 54.51,5.98 54.51,6.8 54.06,7.25 54.06,9.07 53.86,9.27 U15.1
  Top 0.152: v17.04,7.75 17.04,7.99 16.9,8.13 U14.1 | U16.1 100.86,9.02 v101.5,8.38 | v69.47,11.15 69.38,11.06 J1.3 69.38,8.38 | U13.2 61.73,12.68 61.87,12.83 62.49,12.83 R17.1 62.51,11.87 66,8.38 69.38,8.38 | 69.38,8.38 69.38,5.91 v69.89,5.4
  Top 0.2: v114.58,14.61 U17.1
  Bottom 0.152: v17.04,7.75 17.04,5.71 17.55,5.21 21.02,5.21 24.65,1.57 48.08,1.57 48.39,1.89 55.37,1.89 v55.52,1.74 64.83,1.74 66.43,3.33 67.7,3.33 69.83,5.46 v69.89,5.4
  Bottom 0.2: v114.58,14.61 108.23,8.26 102.26,8.26 102.13,8.38 v101.5,8.38 100.83,7.72 98.04,7.72 92.85,12.91 88.49,12.91 85.9,10.32 79.5,10.32 78.74,11.08 71.12,11.08 70.52,11.68 70,11.68 | v69.47,11.15 69.47,11.54 69.62,11.68 70,11.68 | TP2.1 70,11.68
SDA_OB  (via drill 0.2)
  Top 0.127: v59.2,12.95 59.33,13.08 U13.7 | U8.20 45.35,16.24 v45.43,16.32
  Top 0.152: U12.4 57.24,9.84 57.43,9.65 v57.43,9.4 57.94,8.89 57.94,7.62 57.18,6.86 U9.7 | v55.37,15.71 55.37,16.66 54.06,17.97 U7.3
  Bottom 0.127: v57.43,9.4 57.82,9.4 57.86,9.36 58.21,9.36 58.45,9.61 58.45,10.85 59.2,11.61 v59.2,12.95 59.59,13.34 59.59,13.84 59.2,14.22 59.2,14.99 | 59.84,14.73 TP4.1 59.71,14.99 59.2,14.99 | v45.43,16.32 45.65,16.55 48.1,16.55 48.68,15.97 55.39,15.97 | 55.39,15.97 56.09,15.97 56.18,15.87 58.57,15.87 59.2,15.24 59.2,14.99 | v55.37,15.71 55.37,15.94 55.39,15.97
SENSE1  (via drill 0.2, 0.24)
  Top 0.127: U10.12 61.37,2.8 60.09,1.52 57.44,1.52 55.86,3.1 55.86,6.89 55.08,7.67 55.08,9.8 53.96,10.92 52.2,10.92 50.7,12.42 50.7,14.81 v50.8,14.92
  Top 0.2: U4.7 36.34,17.19 | 36.34,17.19 35.07,17.19 34.39,17.86 28.17,17.86 27.71,17.4 R31.1 | v36.34,16.07 36.34,17.19
  Bottom 0.2: v50.8,14.92 50.76,14.92 50.26,15.42 48.45,15.42 48.2,15.68 37.37,15.68 36.98,16.07 v36.34,16.07
SENSE1+
  Top 0.2: U4.5 38.35,15.89 38.7,16.25 38.7,17.83 38.02,18.52 11.6,18.52 8.64,15.55 8.64,9.59 7.9,8.85 7.9,6.22 8.24,5.88 R5.1
  Top 0.61: Q5.3 11.93,2.03 10.69,3.28 10.69,5.28 10.09,5.88 R5.1
SENSE1_FILT
  Top 0.2: R31.2 C14.1 23.91,16.52 23.04,15.65 U5.2
SENSE2  (via drill 0.2, 0.24)
  Top 0.127: U10.14 62.37,2.91 60.72,1.26 57.33,1.26 55.6,2.99 55.6,6.79 54.82,7.57 54.82,9.7 53.85,10.67 52.09,10.67 50.07,12.69 v49.92,12.69
  Top 0.2: U4.1 36.85,13.29 36.72,13.42 34.69,13.42 | 34.69,13.42 34.3,13.42 33.07,12.18 28.71,12.18 27.84,11.3 R32.1 | v34.69,13.84 34.69,13.42
  Bottom 0.2: v34.69,13.84 35.12,14.27 47.6,14.27 48.06,13.81 48.06,13.55 48.33,13.28 49.67,13.28 49.92,13.03 v49.92,12.69
SENSE2+  (via drill 0.2)
  Top 0.2: v42.26,6.66 42.26,6.15 41.77,5.65 41.77,3.52 43.27,2.02 45.52,2.02 46.84,3.34 R6.1 | U4.3 38.39,14.59 38.89,14.1 v38.89,12
  Top 0.508: Q6.3 47.65,2.84 R6.1
  Bottom 0.2: v42.26,6.66 42.39,6.66 43.12,7.39 43.12,7.74 42.73,8.13 41.54,8.13 40.03,9.64 40.03,9.65 38.89,10.79 v38.89,12
SENSE2_FILT
  Top 0.2: R32.2 C15.1 23.91,12.69 23.55,13.05 U5.6
SENSE3  (via drill 0.2, 0.24)
  Top 0.127: U10.15 62.87,2.9 60.98,1.01 57.23,1.01 55.35,2.88 55.35,6.68 54.57,7.46 54.57,9.59 53.75,10.41 51.97,10.41 50.43,11.96 v49.92,11.96
  Top 0.2: v33.55,13.36 33.48,13.29 U4.14 30.35,13.29 R33.1
  Bottom 0.2: v33.55,13.36 35.78,13.36 36.37,13.95 47.47,13.95 47.73,13.68 47.73,13.41 48.19,12.95 48.93,12.95 v49.92,11.96
SENSE3+  (via drill 0.2)
  Top 0.2: R7.1 90.41,3.72 90.21,3.92 90.21,4.36 86.36,8.22 v85.49,8.22 | v33.93,14.61 33.92,14.59 U4.12
  Top 0.508: R7.1 91.08,3.34 91.76,2.66 Q7.3
  Bottom 0.127: v85.49,8.22 84.77,8.94 78.93,8.94 78.3,9.57 67.48,9.57 63.14,13.91 63.14,14.93 61.01,17.06 57.3,17.06 56.37,17.06 56.16,16.86 49.63,16.86 49.43,17.06 36.42,17.06 33.97,14.61 v33.93,14.61
SENSE3_FILT
  Top 0.2: U5.9 28.81,13.05 R33.2 C16.1
SENSE4  (via drill 0.2, 0.24)
  Top 0.127: U10.11 60.87,3.03 59.61,1.77 57.54,1.77 56.11,3.2 56.11,7 55.33,7.78 55.33,9.91 54.06,11.18 52.3,11.18 50.97,12.51 50.97,14.5 51.22,14.75 51.22,15.09 50.98,15.34 50.56,15.34 v50.09,14.87
  Top 0.2: v35.79,15.54 34.14,17.19 U4.8 30.18,17.19 R34.1
  Bottom 0.2: v50.09,14.87 49.8,14.87 49.57,15.1 48.31,15.1 48.1,15.31 37.28,15.31 37.05,15.54 v35.79,15.54
SENSE4+  (via drill 0.2)
  Top 0.2: R8.1 122.16,4.87 121.69,5.33 v121.69,6.1 | v33.17,15.88 31.66,15.88 U4.10
  Top 0.508: R8.1 123.76,4.19 Q8.3
  Bottom 0.127: v121.69,6.1 121.31,6.48 98,6.48 92.44,12.04 89.12,12.04 86.53,9.45 79.14,9.45 78.51,10.08 67.69,10.08 63.65,14.12 63.65,15.14 61.22,17.57 56.16,17.57 55.95,17.36 49.84,17.36 49.64,17.57 34.86,17.57 v33.17,15.88
SENSE4_FILT
  Top 0.2: U5.13 27.98,15.65 28.33,16 C17.1 R34.2
SENSE_EN  (via drill 0.2)
  Top 0.127: v24.56,7.81 U2.5
  Top 0.152: v48.52,14.64 48.52,14.57 47.15,13.21 U8.15
  Top 0.2: v56.44,14.5 58.82,16.89 62.99,16.89 63.03,16.93 63.52,16.93 63.66,17.08 R9.2 64.52,17.65 v64.72,17.45 | v64.71,16.05 64.63,16.12 U3.4
  Bottom 0.127: v24.56,7.81 25.57,7.81 26.12,8.36 26.12,8.83 25.36,9.59 25.36,12.79 25.77,13.2 32.48,13.2 33.08,13.8 34.03,13.8 34.8,14.56 35.41,14.56 36,15.15 36.52,15.15 36.65,15.02 47.98,15.02 48.2,14.81 48.35,14.81 v48.52,14.64
  Bottom 0.152: v56.44,14.5 56.44,13.49 54.16,11.21 52.25,11.21 50.96,12.5 50.96,14.27 50.83,14.39 49.96,14.39 49.79,14.57 49.67,14.57 49.59,14.64 v48.52,14.64
  Bottom 0.2: v64.72,17.45 v64.72,16.05 v64.71,16.05
SWITCHED_SENSE
  Top 0.254: U12.1 59.94,7.94 60.11,8.12 60.11,8.56 60.49,8.94 60.49,9.29 60.73,9.53 62,9.53 62.14,9.67 U11.4
VPORT1_OUT  (via drill 0.2)
  Top 0.127: v66.87,4.4 66.87,7.61 v66.91,7.66
  Top 0.2: U10.1 64.15,5.33 v64.25,5.43 | U4.6 38.15,16.54 38.38,16.76 38.38,17.53 37.71,18.19 11.74,18.19 8.96,15.42 8.96,9.32 8.28,8.64 8.28,7.87 8.57,7.58 R5.2 | C13.1 13.87,4.95 14.12,4.7 15.39,4.7 15.52,4.83 U14.6
  Top 0.254: C13.1 R19.2 R23.2 10.83,5.95 10.31,6.48 10.31,7.24 9.97,7.58 R5.2
  Top 0.61: R5.2 9.17,8.47 9.51,8.81 9.51,11.56 10.29,12.34 11.79,12.34 12.45,11.68 12.45,10.2 J2.2
  Bottom 0.127: v66.87,4.4 66.65,4.4 64.66,2.41 47.62,2.41 47.56,2.35 41.44,2.35 40.99,2.81 39.7,2.81 39.34,2.45 25.05,2.45 20.13,7.38 20.13,7.92 19.88,8.16 17.61,8.16 16.47,9.31 15.34,9.31 15.06,9.03 J2.2
  Bottom 0.2: v64.25,5.43 64.76,5.43 66.91,7.58 v66.91,7.66
VPORT2_OUT  (via drill 0.2, 0.25)
  Top 0.2: U10.5 61.37,6.89 61,7.26 v59.48,7.26 | 53.24,4.7 53.24,5.17 53.03,5.38 52.73,5.38 52.61,5.5 U15.6 | 53.24,4.7 53.24,4.23 53.03,4.02 52.01,4.02 51.41,4.62 51.41,6.14 51.2,6.35 R20.2 C10.1 49.28,7.1 48.78,6.6 48.78,5.33 48.5,5.04 R6.2 46.92,5.04 46.57,4.68 46.57,3.65 45.26,2.35 43.41,2.35 42.1,3.65 42.1,5.51 42.77,6.18 42.77,7.05 42.53,7.29 v42.53,7.44 | R24.2 53.24,4.7 | v38.12,12 38.12,12.83 38.38,13.08 38.38,13.72 38.15,13.94 U4.2
  Top 0.61: J3.2 46.95,8.39 46.56,8 46.56,6.89 47.65,5.8 R6.2
  Bottom 0.2: v59.48,7.26 59.48,6.03 58.98,5.53 58.37,5.53 57.3,6.6 54.38,6.6 54.12,6.35 54.12,5.21 52.78,3.86 49.02,3.86 48.43,4.45 48.43,5.31 46.76,6.97 46.76,9.1 J3.2 | v42.53,7.44 41.77,7.44 38.12,11.09 v38.12,12
VPORT3_OUT  (via drill 0.2)
  Top 0.2: v32.79,14.1 32.63,13.94 U4.13 | v86.13,8.67 86.36,8.67 89.87,5.17 90.83,5.17 R7.2 | v63.49,6.73 63.47,6.73 63.12,6.38 U10.2 | U16.6 97.69,5.72 97.5,5.52 96.61,5.52 95.91,6.22 94.89,6.22 94.77,6.35 R25.2
  Top 0.254: R21.2 R25.2 C11.1
  Top 0.61: J4.2 89.06,8.9 89.06,6.89 89.85,6.1 91.08,6.1 | R21.2 92.46,6.97 91.6,6.1 91.08,6.1 | R7.2 91.08,6.1
  Bottom 0.127: v86.13,8.67 85.61,9.19 79.04,9.19 78.4,9.83 67.58,9.83 63.4,14.02 63.4,15.03 61.12,17.31 56.26,17.31 56.06,17.11 49.73,17.11 49.53,17.31 36,17.31 v32.79,14.1
  Bottom 0.2: v63.49,6.73 65.21,8.45 70.99,8.45 72.55,6.9 82.03,6.9 83.45,8.32 84.74,8.32 85.31,7.76 87.92,7.76 J4.2
VPORT4_OUT  (via drill 0.2, 0.25, 0.35)
  Top 0.2: R8.2 121.98,6.57 v121.69,6.86 | v33.17,16.64 33.07,16.54 U4.9 | U10.4 v61.86,7.24
  Top 0.254: U17.6 116.99,17.78 117.24,18.03 118.39,18.03 118.9,17.53 C12.1 R26.2 R22.2 122.44,16.65 v122.58,16.51
  Top 0.508: R8.2 v123.09,8.26
  Bottom 0.127: v121.69,6.86 121.56,6.73 98.11,6.73 92.55,12.29 89.02,12.29 86.43,9.7 79.25,9.7 78.61,10.34 67.8,10.34 63.9,14.23 63.9,15.24 61.33,17.82 56.05,17.82 55.85,17.62 49.95,17.62 49.75,17.82 34.35,17.82 v33.17,16.64
  Bottom 0.2: v61.86,7.24 61.86,6.52 62.65,5.73 63.41,5.73 65.8,8.12 70.86,8.12 72.41,6.57 82.16,6.57 83.53,7.94 84.66,7.94 85.17,7.43 87.15,7.43 88.97,5.61 121.96,5.61 123.09,6.73 v123.09,8.26
  Bottom 0.254: v123.09,8.26 123.09,9.19 123.46,9.56 123.46,11.44 122.58,12.32 v122.58,16.51
  Bottom 0.61: v123.09,8.26 123.72,8.26 124.41,8.94 124.41,10.56 125.19,11.34 125.74,11.34 J5.2
VREF  (via drill 0.25)
  Top 0.254: U5.10 24.41,13.7 | 24.41,13.7 U5.5 | U5.12 24.41,15 | 24.41,15 U5.3 | 24.41,15 v24.41,14.34 24.41,13.7 | R10.1 17.55,14.72 17.95,15.11 v19.58,15.11
  Top 0.305: R10.1 15.39,14.72 15.09,14.42 D1.1
  Bottom 0.254: v19.58,15.11 21.87,15.11 23.01,13.97 24.04,13.97 v24.41,14.34

## Text on the board
Reference: v1.1
tDocu: Port4 | Port1 | Port3 | Talon - I2C / v2.1 / Bobby Schulz | Port2
bDocu: SDA_OB | SCL | SDA | GND | SCL_OB | INTB | SN